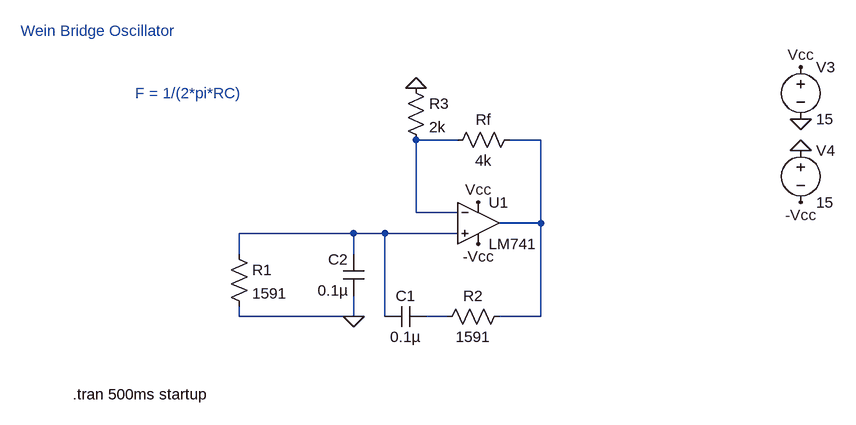
[diagram p0: schematic Wein_Bridge_Oscillator.asc]
Wein_Bridge_Oscillator.asc, the LTspice schematic file:
Version 4
SHEET 1 1236 680
WIRE 416 96 352 96
WIRE 544 96 496 96
WIRE 352 208 352 96
WIRE 416 208 352 208
WIRE 544 224 544 96
WIRE 544 224 480 224
WIRE 256 240 80 240
WIRE 304 240 256 240
WIRE 416 240 304 240
WIRE 80 272 80 240
WIRE 256 272 256 240
WIRE 80 368 80 352
WIRE 256 368 256 336
WIRE 256 368 80 368
WIRE 304 368 304 240
WIRE 400 368 368 368
WIRE 544 368 544 224
WIRE 544 368 480 368
FLAG 944 112 0
FLAG 944 64 0
FLAG 944 -16 Vcc
FLAG 944 192 -Vcc
FLAG 448 256 -Vcc
FLAG 448 192 Vcc
FLAG 256 368 0
FLAG 352 16 0
SYMBOL OpAmps\\LM741 448 160 R0
SYMATTR InstName U1
SYMBOL voltage 944 -32 R0
SYMATTR InstName V3
SYMATTR Value 15
SYMBOL voltage 944 96 R0
SYMATTR InstName V4
SYMATTR Value 15
SYMBOL res 64 256 R0
SYMATTR InstName R1
SYMATTR Value 1591
SYMBOL res 496 352 R90
WINDOW 0 0 56 VBottom 2
WINDOW 3 32 56 VTop 2
SYMATTR InstName R2
SYMATTR Value 1591
SYMBOL cap 368 352 R90
WINDOW 0 0 32 VBottom 2
WINDOW 3 32 32 VTop 2
SYMATTR InstName C1
SYMATTR Value 0.1µ
SYMBOL cap 272 336 R180
WINDOW 0 24 56 Left 2
WINDOW 3 24 8 Left 2
SYMATTR InstName C2
SYMATTR Value 0.1µ
SYMBOL res 336 0 R0
SYMATTR InstName R3
SYMATTR Value 2k
SYMBOL res 512 80 R90
WINDOW 0 0 56 VBottom 2
WINDOW 3 32 56 VTop 2
SYMATTR InstName Rf
SYMATTR Value 4k
TEXT -176 488 Left 2 !.tran 500ms startup
TEXT -256 -72 Left 2 ;Wein Bridge Oscillator
TEXT -80 24 Left 2 ;F = 1/(2*pi*RC)

The netlist it stands for:
* Wein_Bridge_Oscillator.asc
XU1 N003 N001 Vcc -Vcc N002 LM741  ; pins In+ In- V+ V- OUT
V3 Vcc 0 15
V4 0 -Vcc 15
R1 N003 0 1591
R2 N002 N004 1591
C1 N004 N003 0.1µ
C2 0 N003 0.1µ
R3 0 N001 2k
Rf N002 N001 4k
.tran 500ms startup
* Wein Bridge Oscillator
* F = 1/(2*pi*RC)
.lib LM741.lib
.backanno
.end

* Results of the author's LTspice run, read from the files saved beside the schematic
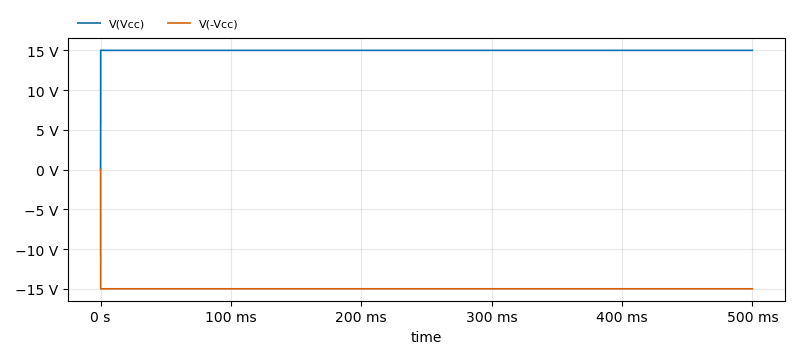
[diagram p1: Transient Analysis of Wein_Bridge_Oscillator.asc, plotted from the saved traces]
* Transient Analysis, 1 run:
*   V(Vcc): min 0 V, max 15 V, average 15 V, rms 15 V, last 15 V
*   V(-Vcc): min -15 V, max 0 V, average -15 V, rms 15 V, last -15 V